# EAGLE schematic PFC MINI (EAGLE 9.2.2)
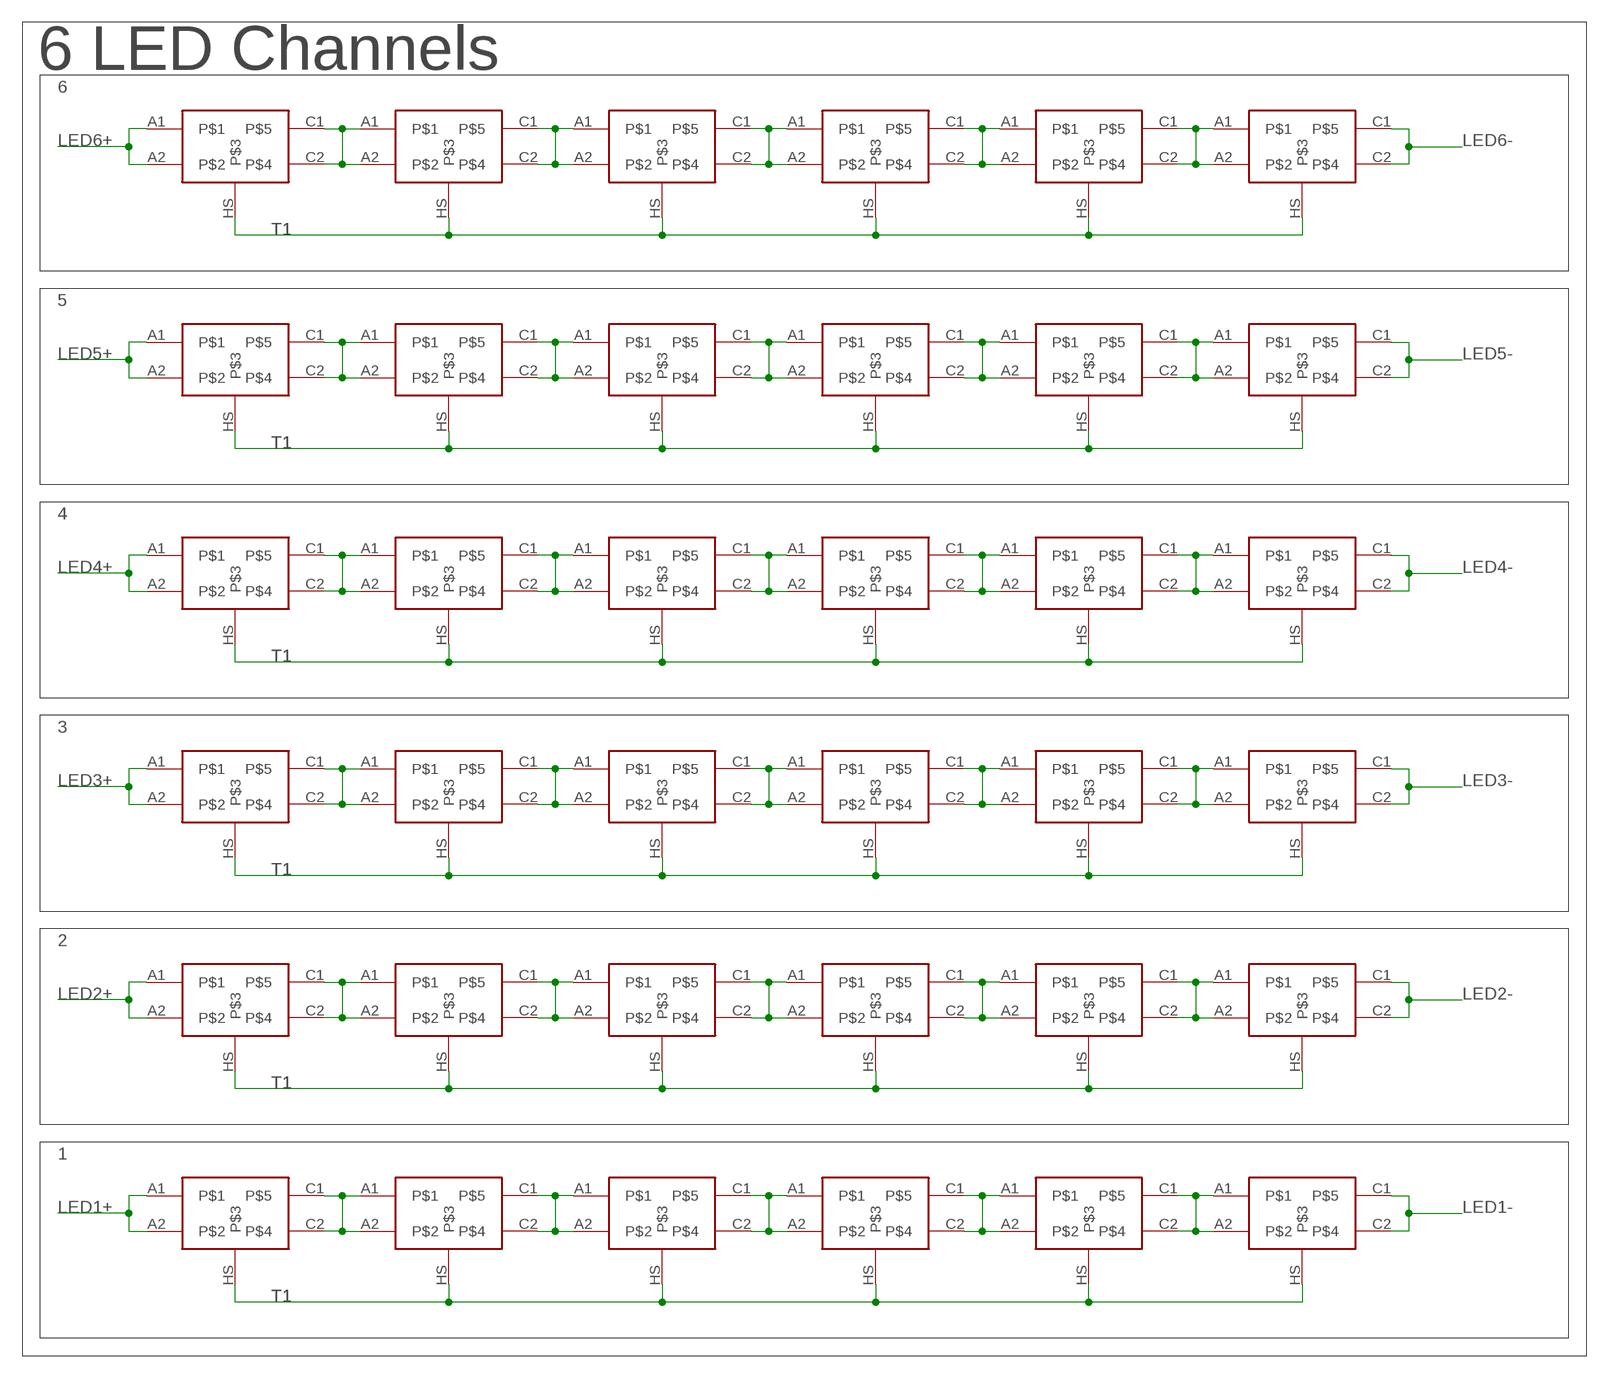
[diagram p0: schematic, sheet 1, part 1 of 3]
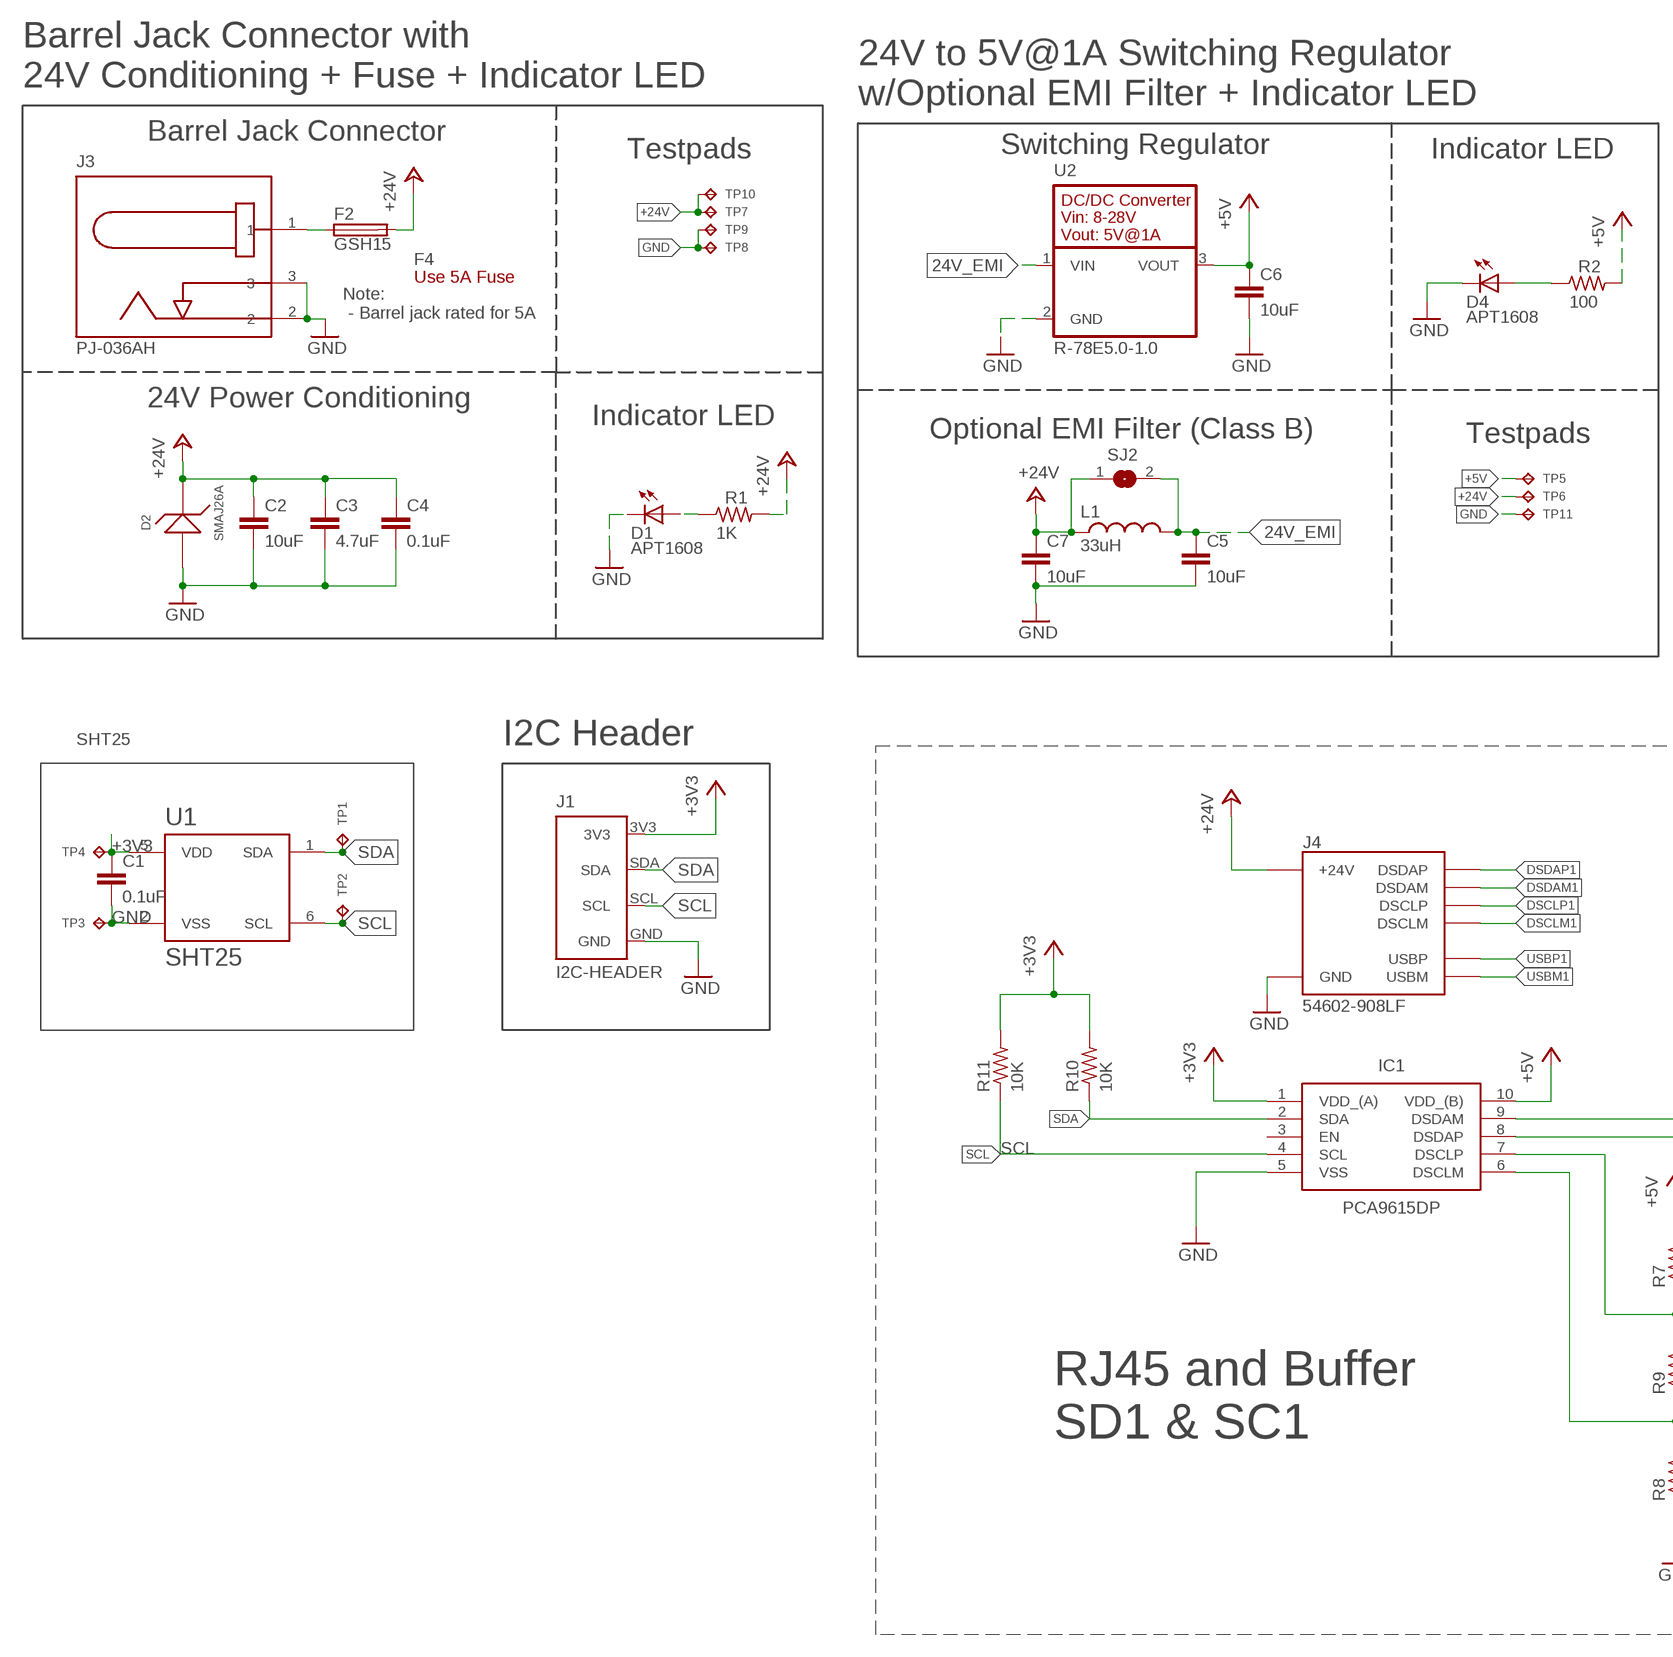
[diagram p1: schematic, sheet 1, part 2 of 3]
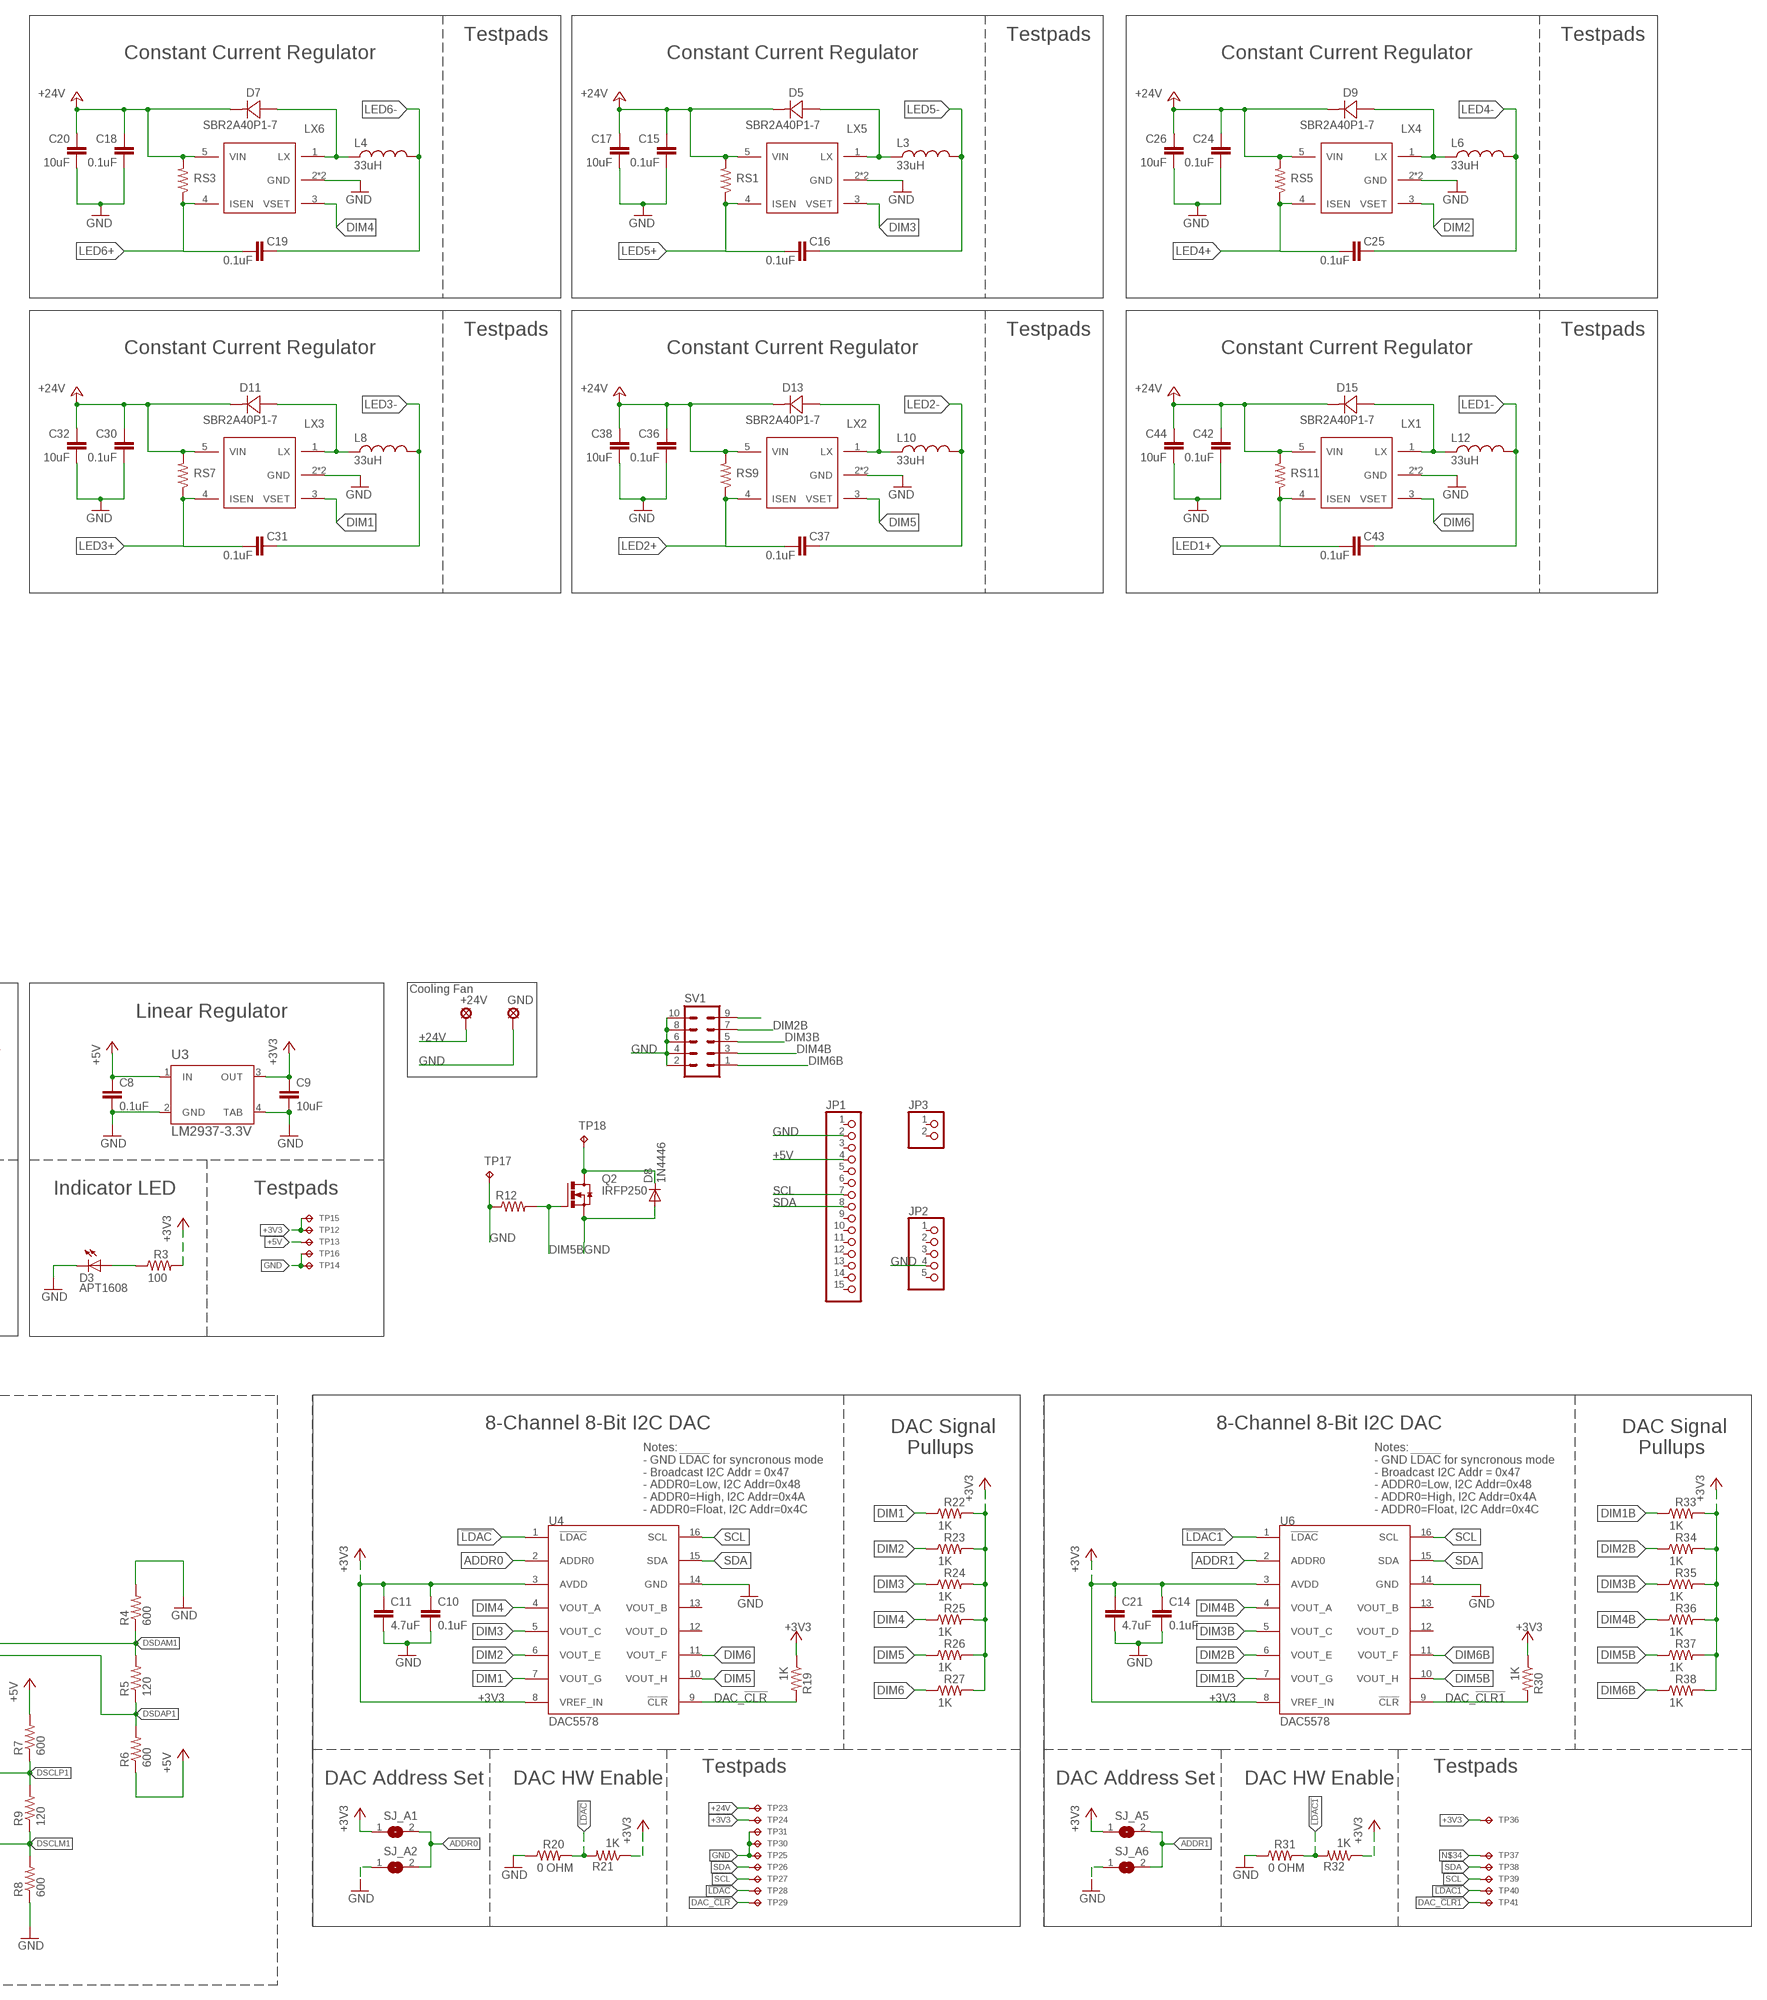
[diagram p2: schematic, sheet 1, part 3 of 3]

## Parts
+24V  LSP10  [LSP10]
C1  0.1uF  0.1UF-C0603C104K5RACTU  [C0603]
C2  10uF  10UF-GMK212BBJ106KG-T  [C0805]
C3  4.7uF  4.7UF-CL21A475KBQNNNE  [C0805]
C4  0.1uF  0.1UF-C0603C104K5RACTU  [C0603]
C5  10uF  10UF-GMK212BBJ106KG-T  [C0805]
C6  10uF  10UF-GMK212BBJ106KG-T  [C0805]
C7  10uF  10UF-GMK212BBJ106KG-T  [C0805]
C8  0.1uF  0.1UF-C0603C104K5RACTU  [C0603]
C9  10uF  10UF-GMK212BBJ106KG-T  [C0805]
C10  0.1uF  0.1UF-C0603C104K5RACTU  [C0603]
C11  4.7uF  4.7UF-CL21A475KBQNNNE  [C0805]
C14  0.1uF  0.1UF-C0603C104K5RACTU  [C0603]
C15  0.1uF  0.1UF-C0603C104K5RACTU  [C0603]
C16  0.1uF  0.1UF-C0603C104K5RACTU  [C0603]
C17  10uF  10UF-GMK212BBJ106KG-T  [C0805]
C18  0.1uF  0.1UF-C0603C104K5RACTU  [C0603]
C19  0.1uF  0.1UF-C0603C104K5RACTU  [C0603]
C20  10uF  10UF-GMK212BBJ106KG-T  [C0805]
C21  4.7uF  4.7UF-CL21A475KBQNNNE  [C0805]
C24  0.1uF  0.1UF-C0603C104K5RACTU  [C0603]
C25  0.1uF  0.1UF-C0603C104K5RACTU  [C0603]
C26  10uF  10UF-GMK212BBJ106KG-T  [C0805]
C30  0.1uF  0.1UF-C0603C104K5RACTU  [C0603]
C31  0.1uF  0.1UF-C0603C104K5RACTU  [C0603]
C32  10uF  10UF-GMK212BBJ106KG-T  [C0805]
C36  0.1uF  0.1UF-C0603C104K5RACTU  [C0603]
C37  0.1uF  0.1UF-C0603C104K5RACTU  [C0603]
C38  10uF  10UF-GMK212BBJ106KG-T  [C0805]
C42  0.1uF  0.1UF-C0603C104K5RACTU  [C0603]
C43  0.1uF  0.1UF-C0603C104K5RACTU  [C0603]
C44  10uF  10UF-GMK212BBJ106KG-T  [C0805]
D1  APT1608  APT1608CGCK  [CHIPLED_0603]
D2  SMAJ26A  SMAJ26A-13-F  [SMA]
D3  APT1608  APT1608CGCK  [CHIPLED_0603]
D4  APT1608  APT1608CGCK  [CHIPLED_0603]
D5  SBR2A40P1-7  [POWERDI123]
D7  SBR2A40P1-7  [POWERDI123]
D8  1N4446  [DO35-10]
D9  SBR2A40P1-7  [POWERDI123]
D11  SBR2A40P1-7  [POWERDI123]
D13  SBR2A40P1-7  [POWERDI123]
D15  SBR2A40P1-7  [POWERDI123]
F2  GSH15  [GSH15]
F4  Use 5A Fuse  0217005.MXP  [FUSE-CARTRIDGE]
GND  LSP10  [LSP10]
IC1  PCA9615DP  [SOP50P490X110-10N]
J1  I2C-HEADER  HEADER-I2C  [HEADER-I2C]
J3  PJ-036AH  BARREL-JACK-PJ-036AH-SMT-TR  [BARREL-JACK-PJ-036AH]
J4  54602-908LF  OPENAG-V1-RJ45PTH  [OPENAG-V1-RJ45]
JP1  PINHD-1X15  [1X15]
JP2  PINHD-1X5  [1X05]
JP3  PINHD-1X2  [1X02]
L1  33uH  33UH-29333C  [29333C]
L3  33uH  33UH-29333C  [29333C]
L4  33uH  33UH-29333C  [29333C]
L6  33uH  33UH-29333C  [29333C]
L8  33uH  33UH-29333C  [29333C]
L10  33uH  33UH-29333C  [29333C]
L12  33uH  33UH-29333C  [29333C]
Q2  IRFP250  [TO-247AD-V]
R1  1K  1K-ERJ-PB3D1001V  [RC0603N]
R2  100  100OHM-RC0603JR-07100RL  [RC0603N]
R3  100  100OHM-RC0603JR-07100RL  [RC0603N]
R4  600  R-US_R0603  [R0603]
R5  120  R-US_R0603  [R0603]
R6  600  R-US_R0603  [R0603]
R7  600  R-US_R0603  [R0603]
R8  600  R-US_R0603  [R0603]
R9  120  R-US_R0603  [R0603]
R10  10K  R-US_R0603  [R0603]
R11  10K  R-US_R0603  [R0603]
R12  R-US_R0603  [R0603]
R19  1K  1K-ERJ-PB3D1001V  [RC0603N]
R20  0 OHM  0OHM-RC0603JR-070RL  [RC0603N]
R21  1K  1K-ERJ-PB3D1001V  [RC0603N]
R22  1K  1K-ERJ-PB3D1001V  [RC0603N]
R23  1K  1K-ERJ-PB3D1001V  [RC0603N]
R24  1K  1K-ERJ-PB3D1001V  [RC0603N]
R25  1K  1K-ERJ-PB3D1001V  [RC0603N]
R26  1K  1K-ERJ-PB3D1001V  [RC0603N]
R27  1K  1K-ERJ-PB3D1001V  [RC0603N]
R30  1K  1K-ERJ-PB3D1001V  [RC0603N]
R31  0 OHM  0OHM-RC0603JR-070RL  [RC0603N]
R32  1K  1K-ERJ-PB3D1001V  [RC0603N]
R33  1K  1K-ERJ-PB3D1001V  [RC0603N]
R34  1K  1K-ERJ-PB3D1001V  [RC0603N]
R35  1K  1K-ERJ-PB3D1001V  [RC0603N]
R36  1K  1K-ERJ-PB3D1001V  [RC0603N]
R37  1K  1K-ERJ-PB3D1001V  [RC0603N]
R38  1K  1K-ERJ-PB3D1001V  [RC0603N]
RS1  6.34 ohm  6.3OHM-RC0805FR-076R34L  [R0805]
RS3  0.66 ohm  6.3OHM-RC0805FR-076R34L  [R0805]
RS5  6.34 ohm  6.3OHM-RC0805FR-076R34L  [R0805]
RS7  6.34 ohm  6.3OHM-RC0805FR-076R34L  [R0805]
RS9  6.34 ohm  6.3OHM-RC0805FR-076R34L  [R0805]
RS11  6.34 ohm  6.3OHM-RC0805FR-076R34L  [R0805]
SJ2  EMI-BYPASS  [EMI-BYPASS]
SJ_A1  SOLDERJUMPERREFLOW_NOPASTE  [SJ1]
SJ_A2  SOLDERJUMPERREFLOW_NOPASTE  [SJ1]
SJ_A5  SOLDERJUMPERREFLOW_NOPASTE  [SJ1]
SJ_A6  SOLDERJUMPERREFLOW_NOPASTE  [SJ1]
SV1  MA05-2  [MA05-2]
TP1  TPTP06R  [TP06R]
TP2  TPTP06R  [TP06R]
TP3  TPTP06R  [TP06R]
TP4  TPTP06R  [TP06R]
TP5  TPTP06R  [TP06R]
TP6  TPTP06R  [TP06R]
TP7  TPTP04R  [TP04R]
TP8  TPTP04R  [TP04R]
TP9  TPTP04R  [TP04R]
TP10  TPTP04R  [TP04R]
TP11  TPTP06R  [TP06R]
TP12  TPTP04R  [TP04R]
TP13  TPTP04R  [TP04R]
TP14  TPTP04R  [TP04R]
TP15  TPTP04R  [TP04R]
TP16  TPTP04R  [TP04R]
TP17  TPPAD1-13  [P1-13]
TP18  TPPAD1-13  [P1-13]
TP23  TPTP04R  [TP04R]
TP24  TPTP04R  [TP04R]
TP25  TPTP04R  [TP04R]
TP26  TPTP04R  [TP04R]
TP27  TPTP04R  [TP04R]
TP28  TPTP04R  [TP04R]
TP29  TPTP04R  [TP04R]
TP30  TPTP04R  [TP04R]
TP31  TPTP04R  [TP04R]
TP36  TPTP04R  [TP04R]
TP37  TPTP04R  [TP04R]
TP38  TPTP04R  [TP04R]
TP39  TPTP04R  [TP04R]
TP40  TPTP04R  [TP04R]
TP41  TPTP04R  [TP04R]
U1  SHT25  [SHT2X]
U2  R-78E5.0-1.0  [R-78E5.0-1.0]
U3  LM2937-3.3V  LM2937IMP-3.3/NOPB  [MP04A]
U4  DAC5578  DAC5578SPW  [TSSOP16]
U6  DAC5578  DAC5578SPW  [TSSOP16]
U$2  MLELED  [MLELEDCREE]
U$3  MLELED  [MLELEDCREE]
U$4  MLELED  [MLELEDCREE]
U$5  MLELED  [MLELEDCREE]
U$6  MLELED  [MLELEDCREE]
U$7  MLELED  [MLELEDCREE]
U$8  MLELED  [MLELEDCREE]
U$9  MLELED  [MLELEDCREE]
U$10  MLELED  [MLELEDCREE]
U$11  MLELED  [MLELEDCREE]
U$12  MLELED  [MLELEDCREE]
U$13  MLELED  [MLELEDCREE]
U$14  MLELED  [MLELEDCREE]
U$15  MLELED  [MLELEDCREE]
U$16  MLELED  [MLELEDCREE]
U$17  MLELED  [MLELEDCREE]
U$18  MLELED  [MLELEDCREE]
U$19  MLELED  [MLELEDCREE]
U$20  MLELED  [MLELEDCREE]
U$21  MLELED  [MLELEDCREE]
U$22  MLELED  [MLELEDCREE]
U$23  MLELED  [MLELEDCREE]
U$24  MLELED  [MLELEDCREE]
U$25  MLELED  [MLELEDCREE]
U$26  MLELED  [MLELEDCREE]
U$27  MLELED  [MLELEDCREE]
U$28  MLELED  [MLELEDCREE]
U$29  MLELED  [MLELEDCREE]
U$30  MLELED  [MLELEDCREE]
U$31  MLELED  [MLELEDCREE]
U$32  MLELED  [MLELEDCREE]
U$33  MLELED  [MLELEDCREE]
U$34  MLELED  [MLELEDCREE]
U$35  MLELED  [MLELEDCREE]
U$36  MLELED  [MLELEDCREE]
U$37  MLELED  [MLELEDCREE]
U$38  AL8861  [AL8861]
U$40  AL8861  [AL8861]
U$42  AL8861  [AL8861]
U$44  AL8861  [AL8861]
U$46  AL8861  [AL8861]
U$48  AL8861  [AL8861]

## Nets
24V_EMI: C5.1 L1.2 SJ2.2 U2.1(VIN)
24V_IN1: F2.1 J3.1
!LDAC1!: R31.2 R32.2 TP40.1(TP) U6.1(!LDAC!)
!LDAC!: R20.2 R21.2 TP28.1(TP) U4.1(!LDAC!)
+3V3: C1.1 C9.1 C10.1 C11.1 C14.1 C21.1 IC1.1(VDD_(A)) J1.3V3 R3.2 R10.2 R11.2 R19.1 R21.1 R22.2 R23.2 R24.2 R25.2 R26.2 R27.2 R30.1 R32.1 R33.2 R34.2 R35.2 R36.2 R37.2 R38.2 SJ_A1.1 SJ_A5.1 TP4.TP TP12.1(TP) TP15.1(TP) TP24.1(TP) TP36.1(TP) U1.5(VDD) U3.3(OUT) U4.3(AVDD) U4.8(VREF_IN) U6.3(AVDD) U6.8(VREF_IN)
+5V: C6.1 C8.1 IC1.10(VDD_(B)) JP1.4 R2.2 R6.1 R7.2 TP5.TP TP13.1(TP) U2.3(VOUT) U3.1(IN)
+24V: +24V.MP C2.1 C3.1 C4.1 C7.1 C15.1 C17.1 C18.1 C20.1 C24.1 C26.1 C30.1 C32.1 C36.1 C38.1 C42.1 C44.1 D2.1 D5.- D7.- D9.- D11.- D13.- D15.- F2.2 J4.24V(6)(+24V) L1.1 R1.2 RS1.2 RS3.2 RS5.2 RS7.2 RS9.2 RS11.2 SJ2.1 TP6.TP TP7.1(TP) TP10.1(TP) TP23.1(TP) U$38.5(VIN) U$40.5(VIN) U$42.5(VIN) U$44.5(VIN) U$46.5(VIN) U$48.5(VIN)
ADDR0: SJ_A1.2 SJ_A2.2 U4.2(ADDR0)
ADDR1: SJ_A5.2 SJ_A6.2 U6.2(ADDR0)
DAC_!CLR1!: R30.2 TP41.1(TP) U6.9(!CLR!)
DAC_!CLR!: R19.2 TP29.1(TP) U4.9(!CLR!)
DIM1: R22.1 U4.7(VOUT_G) U$44.3(VSET)
DIM1B: R33.1 U6.7(VOUT_G)
DIM2: R23.1 U4.6(VOUT_E) U$42.3(VSET)
DIM2B: R34.1 SV1.7 U6.6(VOUT_E)
DIM3: R24.1 U4.5(VOUT_C) U$38.3(VSET)
DIM3B: R35.1 SV1.5 U6.5(VOUT_C)
DIM4: R25.1 U4.4(VOUT_A) U$40.3(VSET)
DIM4B: R36.1 SV1.3 U6.4(VOUT_A)
DIM5: R26.1 U4.10(VOUT_H) U$46.3(VSET)
DIM5B: Q2.G R12.2 R37.1 U6.10(VOUT_H)
DIM6: R27.1 U4.11(VOUT_F) U$48.3(VSET)
DIM6B: R38.1 SV1.1 U6.11(VOUT_F)
DSCLM1: IC1.6(DSCLM) J4.DSCLM(5)(DSCLM) R8.2 R9.1
DSCLP1: IC1.7(DSCLP) J4.DSCLP(4)(DSCLP) R7.1 R9.2
DSDAM1: IC1.9(DSDAM) J4.DSDAM(2)(DSDAM) R4.1 R5.2
DSDAP1: IC1.8(DSDAP) J4.DSDAP(1)(DSDAP) R5.1 R6.2
GND: C1.2 C2.2 C3.2 C4.2 C5.2 C6.2 C7.2 C8.2 C9.2 C10.2 C11.2 C14.2 C15.2 C17.2 C18.2 C20.2 C21.2 C24.2 C26.2 C30.2 C32.2 C36.2 C38.2 C42.2 C44.2 D1.C D2.2 D3.C D4.C D8.A GND.MP IC1.5(VSS) J1.GND J3.2 J3.3 J4.GND(3)(GND) JP1.2 JP2.4 Q2.S R4.2 R8.1 R12.1 R20.1 R31.1 SJ_A2.1 SJ_A6.1 SV1.2 SV1.4 SV1.6 SV1.8 SV1.10 TP3.TP TP8.1(TP) TP9.1(TP) TP11.TP TP14.1(TP) TP16.1(TP) TP17.TP TP25.1(TP) TP30.1(TP) TP31.1(TP) U1.2(VSS) U2.2(GND) U3.2(GND) U3.4(TAB) U4.14(GND) U6.14(GND) U$38.2(GND) U$38.44(GND) U$40.2(GND) U$40.44(GND) U$42.2(GND) U$42.44(GND) U$44.2(GND) U$44.44(GND) U$46.2(GND) U$46.44(GND) U$48.2(GND) U$48.44(GND)
LED1+: C43.2 RS11.1 U$2.A1 U$2.A2 U$48.4(ISEN)
LED1-: C43.1 L12.2 U$7.C1 U$7.C2
LED2+: C37.2 RS9.1 U$8.A1 U$8.A2 U$46.4(ISEN)
LED2-: C37.1 L10.2 U$13.C1 U$13.C2
LED3+: C31.2 RS7.1 U$14.A1 U$14.A2 U$44.4(ISEN)
LED3-: C31.1 L8.2 U$19.C1 U$19.C2
LED4+: C25.2 RS5.1 U$20.A1 U$20.A2 U$42.4(ISEN)
LED4-: C25.1 L6.2 U$25.C1 U$25.C2
LED5+: C16.2 RS1.1 U$26.A1 U$26.A2 U$38.4(ISEN)
LED5-: C16.1 L3.2 U$31.C1 U$31.C2
LED6+: C19.2 RS3.1 U$32.A1 U$32.A2 U$40.4(ISEN)
LED6-: C19.1 L4.2 U$37.C1 U$37.C2
LX1: D15.+ L12.1 U$48.1(LX)
LX2: D13.+ L10.1 U$46.1(LX)
LX3: D11.+ L8.1 U$44.1(LX)
LX4: D9.+ L6.1 U$42.1(LX)
LX5: D5.+ L3.1 U$38.1(LX)
LX6: D7.+ L4.1 U$40.1(LX)
N$1: D1.A R1.1
N$2: U$2.C1 U$2.C2 U$3.A1 U$3.A2
N$3: D4.A R2.1
N$4: D3.A R3.1
N$5: U$8.C1 U$8.C2 U$9.A1 U$9.A2
N$6: U$3.C1 U$3.C2 U$4.A1 U$4.A2
N$7: U$9.C1 U$9.C2 U$10.A1 U$10.A2
N$8: U$4.C1 U$4.C2 U$5.A1 U$5.A2
N$9: U$10.C1 U$10.C2 U$11.A1 U$11.A2
N$10: U$5.C1 U$5.C2 U$6.A1 U$6.A2
N$11: U$6.C1 U$6.C2 U$7.A1 U$7.A2
N$12: U$11.C1 U$11.C2 U$12.A1 U$12.A2
N$13: U$12.C1 U$12.C2 U$13.A1 U$13.A2
N$14: U$14.C1 U$14.C2 U$15.A1 U$15.A2
N$15: U$15.C1 U$15.C2 U$16.A1 U$16.A2
N$16: U$16.C1 U$16.C2 U$17.A1 U$17.A2
N$17: U$17.C1 U$17.C2 U$18.A1 U$18.A2
N$18: U$18.C1 U$18.C2 U$19.A1 U$19.A2
N$19: U$20.C1 U$20.C2 U$21.A1 U$21.A2
N$20: U$21.C1 U$21.C2 U$22.A1 U$22.A2
N$21: U$22.C1 U$22.C2 U$23.A1 U$23.A2
N$22: U$23.C1 U$23.C2 U$24.A1 U$24.A2
N$23: U$24.C1 U$24.C2 U$25.A1 U$25.A2
N$24: U$26.C1 U$26.C2 U$27.A1 U$27.A2
N$25: U$27.C1 U$27.C2 U$28.A1 U$28.A2
N$26: U$28.C1 U$28.C2 U$29.A1 U$29.A2
N$27: U$29.C1 U$29.C2 U$30.A1 U$30.A2
N$28: U$30.C1 U$30.C2 U$31.A1 U$31.A2
N$29: U$32.C1 U$32.C2 U$33.A1 U$33.A2
N$30: U$33.C1 U$33.C2 U$34.A1 U$34.A2
N$31: U$34.C1 U$34.C2 U$35.A1 U$35.A2
N$32: U$35.C1 U$35.C2 U$36.A1 U$36.A2
N$33: U$36.C1 U$36.C2 U$37.A1 U$37.A2
N$34: TP37.1(TP)
N$36: D8.C Q2.D TP18.TP
N$38: SV1.9
SCL: IC1.4(SCL) J1.SCL JP1.7 R11.1 TP2.TP TP27.1(TP) TP39.1(TP) U1.6(SCL) U4.16(SCL) U6.16(SCL)
SDA: IC1.2(SDA) J1.SDA JP1.8 R10.1 TP1.TP TP26.1(TP) TP38.1(TP) U1.1(SDA) U4.15(SDA) U6.15(SDA)
T1: U$2.HS U$3.HS U$4.HS U$5.HS U$6.HS U$7.HS U$8.HS U$9.HS U$10.HS U$11.HS U$12.HS U$13.HS U$14.HS U$15.HS U$16.HS U$17.HS U$18.HS U$19.HS U$20.HS U$21.HS U$22.HS U$23.HS U$24.HS U$25.HS U$26.HS U$27.HS U$28.HS U$29.HS U$30.HS U$31.HS U$32.HS U$33.HS U$34.HS U$35.HS U$36.HS U$37.HS
USBM1: J4.USBM(8)(USBM)
USBP1: J4.USBP(7)(USBP)
Unconnected: IC1.3(EN) JP1.1 JP1.3 JP1.5 JP1.6 JP1.9 JP1.10 JP1.11 JP1.12 JP1.13 JP1.14 JP1.15 JP2.1 JP2.2 JP2.3 JP2.5 JP3.1 JP3.2 U4.12(VOUT_D) U4.13(VOUT_B) U6.12(VOUT_D) U6.13(VOUT_B)

## Notes on the sheet
- 6 LED Channels
- 6
- 5
- Testpads | Testpads | Testpads
- 4
- Constant Current Regulator | Constant Current Regulator | Constant Current Regulator
- 3
- 2 | Testpads | Testpads | Testpads
- Constant Current Regulator | Constant Current Regulator | Constant Current Regulator
- 1
- Barrel Jack Connector with
  24V Conditioning + Fuse + Indicator LED
- 24V to 5V@1A Switching Regulator
  w/Optional EMI Filter + Indicator LED
- Barrel Jack Connector | Cooling Fan
- Testpads | Switching Regulator | Indicator LED
- Linear Regulator
- Note:
   - Barrel jack rated for 5A
- 24V Power Conditioning
- Indicator LED
- Optional EMI Filter (Class B) | Testpads | Indicator LED | Testpads
- SHT25 | I2C Header
- 8-Channel 8-Bit I2C DAC | 8-Channel 8-Bit I2C DAC
- DAC Signal 
     Pullups
- DAC Signal 
     Pullups
- Notes:
  - GND !LDAC! for syncronous mode
  - Broadcast I2C Addr = 0x47
  - ADDR0=Low, I2C Addr=0x48
  - ADDR0=High, I2C Addr=0x4A
  - ADDR0=Float, I2C Addr=0x4C
- Notes:
  - GND !LDAC! for syncronous mode
  - Broadcast I2C Addr = 0x47
  - ADDR0=Low, I2C Addr=0x48
  - ADDR0=High, I2C Addr=0x4A
  - ADDR0=Float, I2C Addr=0x4C
- Testpads | Testpads
- DAC Address Set | DAC HW Enable | DAC Address Set | DAC HW Enable
- RJ45 and Buffer
  SD1 & SC1

## Library data of the parts
+24V GND = solpad:LSP10: SOLDER PAD drill 1.0 mm, distributor Buerklin, 12H555
C1 C4 C8 C10 C14-C16 C18 C19 C24 C25 C30 C31 C36 C37 C42 C43 = openag-capacitors:0.1UF-C0603C104K5RACTU: CAP CER 0.1UF 50V X7R 0603 Description: 0.1µF ±10% 50V Ceramic Capacitor X7R 0603 (1608 Metric) Technical Specifications: Capacitance: 0.1µF Tolerance: ±10% Rated Voltage: 50V Temperature Coefficient: X7R Operating Temperature: -55°C ~ 125°C Package / Case: 0603 (1608 Metric) Datasheet(s): X7R Dielectric, 6.3-250 VDC <https://search.kemet.com/component-edge/download/datasheet/C0603C104K5RACTU.pdf> Vendor(s): Digikey: 399-5089-1-ND <https://www.digikey.com/product-detail/en/kemet/C0603C104K5RACTU/399-5089-1-ND/1465623>; MANUFACTURER: Kemet; MPN: C0603C104K5RACTU; VENDOR: Digikey; VLINK: https://www.digikey.com/product-detail/en/kemet/C0603C104K5RACTU/399-5089-1-ND/1465623; VPN: 399-5089-1-ND
C2 C5-C7 C9 C17 C20 C26 C32 C38 C44 = openag-capacitors:10UF-GMK212BBJ106KG-T: CAP CER 10UF 35V X5R 0805 Description: 10µF ±10% 35V Ceramic Capacitor X5R 0805 (2012 Metric) Technical Specifications: Capacitance: 10µF Tolerance: ±10% Rated Voltage: 35V Temperature Coefficient: X5R Operating Temperature: -55°C ~ 85°C Package / Case: 0805 (2012 Metric) Datasheet(s): GMK212BBJ106KG-T Spec <http://ds.yuden.co.jp/TYCOMPAS/ut/detail.do?productNo=GMK212BBJ106KG-T&fileName=GMK212BBJ106KG-T_SS&mode=specSheetDownload> Vendor(s): Digikey: 587-4893-1-ND <https://www.digikey.com/product-detail/en/taiyo-yuden/GMK212BBJ106KG-T/587-4893-1-ND/6563736>; MANUFACTURER: Taiyo Yuden; MPN: GMK212BBJ106KG-T; VENDOR: Digikey; VLINK: https://www.digikey.com/product-detail/en/taiyo-yuden/GMK212BBJ106KG-T/587-4893-1-ND/6563736; VPN: 587-4893-1-ND
C3 C11 C21 = openag-capacitors:4.7UF-CL21A475KBQNNNE: CAP CER 4.7UF 50V X5R 0805 Description: 4.7µF ±10% 50V Ceramic Capacitor X5R 0805 (2012 Metric) Technical Specifications: Capacitance: 4.7uF Tolerance: ±10% Rated Voltage: 50V Temperature Coefficient: X5R Operating Temperature: -55°C ~ 85°C Package/Case: 0805 (2012 Metric) Datasheet(s): CL21A475KBQNNNE Characteristics <http://www.samsungsem.com/kr/front/downloadcms.do?path=/kr/support/product-search/mlcc/__icsFiles/afieldfile/2014/11/05&fileName=C_CL21A475KBQNNNE.pdf> Vendor(s): Digikey: 1276-1248-1-ND <https://www.digikey.com/product-detail/en/samsung-electro-mechanics/CL21A475KBQNNNE/1276-1248-1-ND/3889334>; MANUFACTURER: Samsung; MPN: CL21A475KBQNNNE; VENDOR: Digikey; VLINK: https://www.digikey.com/product-detail/en/samsung-electro-mechanics/CL21A475KBQNNNE/1276-1248-1-ND/3889334; VPN: 1276-1248-1-ND
D1 D3 D4 = openag-diodes:APT1608CGCK: LED GREEN CLEAR 0603 SMD Description: Green 570nm LED Indication - Discrete 2.1V 0603 (1608 Metric) Technical Specifications: Color: Green Lens Color: Colorless Lens Transparency: Clear Millicandela Rating: 50mcd Lens Style/Size: Rectangle with Flat Top, 1.20mm x 0.80mm Voltage - Forward (Vf) (Typ): 2.1V Current - Test: 20mA Viewing Angle: 120° Mounting Type: Surface Mount Wavelength - Dominant: 570nm Wavelength - Peak: 574nm Package / Case: 0603 (1608 Metric) Supplier Device Package: Chip LED Size / Dimension: 1.60mm L x 0.80mm W Height (Max): 0.75mm Datasheet(s): APT1608CGCK <http://www.kingbrightusa.com/images/catalog/SPEC/APT1608CGCK.pdf> Vendor(s): Digikey: 754-1116-1-ND <https://www.digikey.com/product-detail/en/kingbright/APT1608CGCK/754-1116-1-ND/1747833#>; MANUFACTURER: Kingbright; MPN: APT1608CGCK; VENDOR: Digikey; VLINK: https://www.digikey.com/product-detail/en/kingbright/APT1608CGCK/754-1116-1-ND/1747833#; VPN: 754-1116-1-ND
D2 = openag-diodes:SMAJ26A-13-F: TVS DIODE 26VWM 42.1VC SMA Description: TVS DIODE 26VWM 42.1VC SMA Technical Specifications: Type: Zener Voltage - Reverse Standoff (Typ): 26V Voltage - Breakdown (Min): 28.9V Voltage - Clamping (Max) @ Ipp: 42.1V Current - Peak Pulse (10/1000µs): 9.5A Power - Peak Pulse: 400W Power Line Protection: No Operating Temperature: -55°C ~ 150°C (TJ) DO-214AC, SMA Datasheet(s): SMAJ5.0(C)A - SMAJ200(C)A Vendor(s): Digikey: SMAJ26A-FDICT-ND <https://www.digikey.com/product-detail/en/diodes-incorporated/SMAJ26A-13-F/SMAJ26A-FDICT-ND/806583>; MANUFACTURER: Diodes Incorporated; MPN: SMAJ26A-13-F; VENDOR: Digikey; VLINK: https://www.digikey.com/product-detail/en/diodes-incorporated/SMAJ26A-13-F/SMAJ26A-FDICT-ND/806583; VPN: SMAJ26A-FDICT-ND
D5 D7 D9 D11 D13 D15 = openag-diodes:SBR2A40P1-7: DIODE SBR 40V 2A POWERDI123 Description: Diode Super Barrier 40V 2A Surface Mount PowerDI™ 123 Technical Specifications: Diode Type: Super Barrier Voltage - DC Reverse (Vr) (Max): 40V Current - Average Rectified (Io): 2A Voltage - Forward (Vf) (Max) @ If: 500mV @ 2A Speed: Standard Recovery >500ns, > 200mA (Io) Current - Reverse Leakage @ Vr: 100µA @ 40V Mounting Type: Surface Mount Package / Case: POWERDI®123 Supplier Device Package: PowerDI™ 123 Operating Temperature - Junction: -65°C ~ 150°C Base Part Number: SBR2A40 Datasheet(s): SBR2A40P1 <https://www.diodes.com/assets/Datasheets/SBR2A40P1.pdf> Vendor(s): Digikey: SBR2A40P1DITR-ND <https://www.digikey.com/product-detail/en/diodes-incorporated/SBR2A40P1-7/SBR2A40P1DITR-ND/1681825>; MANUFACTURER: Diodes Incorporated; MPN: SBR2A40P1-7; VENDOR: Digikey; VLINK: https://www.digikey.com/product-detail/en/diodes-incorporated/SBR2A40P1-7/SBR2A40P1DITR-ND/1681825; VPN: SBR2A40P1DITR-ND
D8 = diode:1N4446: DIODE high speed (Philips)
F2 = openag-fuses:GSH15: FUSE BLOCK CART 250V 6.3A PCB Description: Fuse Block 6.3A 250V 1 Circuit Cartridge PCB Technical Specifications: Fuseholder Type: Block Fuse Type: Cartridge For Use With/Related Products: 5mm x 20mm Fuse Size: 5mm x 20mm Number of Circuits: 1 Voltage: 250V Current Rating: 6.3A Mounting Type: PCB Orientation: Horizontal Termination Style: PC Pin Contact Material: Copper Alloy Contact Finish: Tin Datasheet(s): 649 Series <http://www.littelfuse.com/~/media/electronics/datasheets/fuse_blocks/littelfuse_fuse_block_649_datasheet.pdf.pdf> Vendor(s): Digikey: WK0011-ND <https://www.digikey.com/product-detail/en/littelfuse-inc/64900001039/WK0011-ND/245470>; MANUFACTURER: Littelfuse Inc.; MPN: 64900001039; VENDOR: Digikey; VLINK: https://www.digikey.com/product-detail/en/littelfuse-inc/64900001039/WK0011-ND/245470; VPN: WK0011-ND
F4 = openag-fuses:0217005.MXP: FUSE GLASS 5A 250VAC 5X20MM Description: FUSE GLASS 5A 250VAC 5X20MM Technical Specifications: Fuse Type: Cartridge, Glass Current Rating: 5A Voltage Rating - AC: 250V Response Time: Fast Package / Case: 5mm x 20mm Mounting Type: Holder Breaking Capacity @ Rated Voltage: 50A Melting I²t: 42.795 Approvals: BSI, CE, CCC, CSA, KC, PSE, SEMKO, UR, VDE Operating Temperature: -55°C ~ 125°C Size / Dimension: 0.205" Dia x 0.787" L (5.20mm x 20.00mm) DC Cold Resistance: 0.0137 Ohms Datasheet(s): 217 Series Datasheet <http://www.littelfuse.com/~/media/electronics/datasheets/fuses/littelfuse_fuse_217_datasheet.pdf.pdf> Vendor(s): Digikey: F1725-ND <https://www.digikey.com/product-detail/en/littelfuse-inc/0217005.MXP/F1725-ND/777549#>; MANUFACTURER: Littelfuse Inc.; MPN: 0217005.MXP; VENDOR: Digikey; VLINK: https://www.digikey.com/product-detail/en/littelfuse-inc/0217005.MXP/F1725-ND/777549; VPN: F1725-ND
IC1 = PCA9615DP:PCA9615DP: Buffer, ReDriver 2 Channel 400kHz 10-TSSOP Source: Datasheet <http://www.nxp.com/docs/en/data-sheet/PCA9615.pdf>; DESCRIPTION: Buffer, ReDriver 2 Channel 400kHz 10-TSSOP; HEIGHT: 1.1mm; MANUFACTURER_NAME: Nexperia; MANUFACTURER_PART_NUMBER: PCA9615DP; SUPPLIER_NAME: RS
J1 = openag-connectors:HEADER-I2C: 100 MIL HEADER I2C CONNECTIONS; MPN: N/A
J3 = openag-connectors:BARREL-JACK-PJ-036AH-SMT-TR: CONN PWR JACK 2X5.5MM SOLDER Description: Power Barrel Connector Jack 2.10mm ID (0.083"), 5.50mm OD (0.217") Surface Mount, Right Angle Technical Specifications: Connector Type: Jack Gender: Male Industry Recognized Mating Diameter: 2.10mm ID (0.083"), 5.50mm OD (0.217") Actual Diameter: 0.078" (2.00mm ID), 0.248" (6.30mm OD) Number of Positions/Contacts: 2 Conductors, 3 Contacts Internal Switch(s): Single Switch, Normally Closed Mounting Type: Surface Mount, Right Angle Termination: Solder Shielding: Unshielded Voltage - Rated: 24VDC Current Rating: 5A Mating Length/Depth: 0.360" (9.15mm) Contact Material - Plating: Silver Operating Temperature: -25°C ~ 85°C Housing Material: Polyamide (PA6T), Nylon 6T Contact Material: Brass; Copper Alloy Body Color: Black Datasheet(s): PJ-036AH-SMT-TR <http://www.cui.com/product/resource/digikeypdf/pj-036ah-smt-tr.pdf> Vendor(s): Digikey: CP-036AHPJCT-ND <https://www.digikey.com/product-detail/en/cui-inc/PJ-036AH-SMT-TR/CP-036AHPJCT-ND/1530994>; MANUFACTURER: CUI Inc.; MPN: PJ-036AH-SMT-TR; VENDOR: Digikey; VLINK: https://www.digikey.com/product-detail/en/cui-inc/PJ-036AH-SMT-TR/CP-036AHPJCT-ND/1530994; VPN: CP-036AHPJCT-ND
J4 = openag_connector:OPENAG-V1-RJ45: Amphenol FCI - 54602-908LF - CONN MOD JACK 8P8C R/A UNSHLD Description: Jack Modular Connector 8p8c (RJ45, Ethernet) 90� Angle (Right) Unshielded Cat3 Technical Specifications: Connector Type: Jack Number of Positions/Contacts: 8p8c (RJ45, Ethernet) Number of Ports: 1 Number of Rows: 1 Mounting Type: Through Hole Orientation: 90� Angle (Right) Termination: Solder Shielding: Unshielded Ratings: Cat3 Features: Board Lock LED Color: Does Not Contain LED Tab Direction: Down Contact Material: Copper Alloy Contact Finish: Gold Contact Finish Thickness: 15�in (0.38�m) Housing Material: Polyester, Glass Filled Operating Temperature: -40�C ~ 70�C Datasheet(s): 54601-x04(zzz)WPLF Drawing <http://cdn.amphenol-icc.com/media/wysiwyg/files/drawing/c-bmj-0102.pdf> Vendor(s): Digikey: 609-1046-ND <https://www.digikey.com/product-detail/en/amphenol-fci/54602-908LF/609-1046-ND/1001360>; POPULATE: YES; VERIFIED: NO
JP1 = pinhead:PINHD-1X15: PIN HEADER
JP2 = pinhead:PINHD-1X5: PIN HEADER
JP3 = pinhead:PINHD-1X2: PIN HEADER
L1 L3 L4 L6 L8 L10 L12 = openag-inductors:33UH-29333C: FIXED IND 33UH 1A 120 MOHM SMD Description: 33µH Shielded Wirewound Inductor 1A 120 mOhm Max Nonstandard Technical Specifications: Type: Wirewound Inductance: 33µH Current Rating: 1A Shielding: Shielded DC Resistance (DCR): 120 mOhm Max Operating Temperature: -40°C ~ 85°C Frequency - Test: 10kHz Mounting Type: Surface Mount Package / Case: Nonstandard Size / Dimension: 0.283" L x 0.283" W (7.20mm x 7.20mm) Height - Seated (Max): 0.157" (4.00mm) Datasheet(s): 2900 Series <https://www.murata-ps.com/data/magnetics/kmp_2900.pdf> Vendor(s): Digikey: 811-1138-1-ND <https://www.digikey.com/product-detail/en/murata-power-solutions-inc/29333C/811-1138-1-ND/1924860>; MANUFACTURER: Murata Power Solutions Inc.; MPN: 29333C; VENDOR: Digikey; VLINK: https://www.digikey.com/product-detail/en/murata-power-solutions-inc/29333C/811-1138-1-ND/1924860; VPN: 811-1138-1-ND
Q2 = transistor-power:IRFP25*: 33A/27A, 200V/150V, 0.085/0.012 Ohm, N-Channel Power MOSFET Source: Fairchild Semiconductor Corporation
R1 R19 R21-R27 R30 R32-R38 = openag-resistors:1K-ERJ-PB3D1001V: RES SMD 1K OHM 0.5% 1/5W 0603 Description: 1 kOhms ±0.5% 0.2W, 1/5W Chip Resistor 0603 (1608 Metric) Automotive AEC-Q200, Pulse Withstanding Thick Film Technical Specifications: Resistance: 1 kOhms Tolerance: ±0.5% Power: 0.2W, 1/5W Operating Temperature: -55°C ~ 155°C Package / Case: 0603 (1608 Metric) Datasheet(s): ERJ-PB3, PB6 Series, High Precision Datasheet <https://industrial.panasonic.com/cdbs/www-data/pdf/RDM0000/AOA0000C328.pdf> Vendor(s): Digikey: P20283CT-ND <https://www.digikey.com/product-detail/en/panasonic-electronic-components/ERJ-PB3D1001V/P20283CT-ND/6214538>; MANUFACTURER: Panasonic; MPN: P20283CT-ND; VENDOR: Digikey; VLINK: https://www.digikey.com/product-detail/en/panasonic-electronic-components/ERJ-PB3D1001V/P20283CT-ND/6214538; VPN: P20283CT-ND
R2 R3 = openag-resistors:100OHM-RC0603JR-07100RL: RES SMD 100 OHM 5% 1/10W 0603 Description: 100 Ohms ±5% 0.1W, 1/10W Chip Resistor 0603 (1608 Metric) Moisture Resistant Thick Film Technical Specifications: Resistance: 100 Ohms Tolerance: ±5% Power (Watts): 0.1W, 1/10W Composition: Thick Film Features: Moisture Resistant Temperature Coefficient: ±100ppm/°C Operating Temperature: -55°C ~ 155°C Package / Case: 0603 (1608 Metric) Supplier Device Package: 0603 Size / Dimension: 0.063" L x 0.032" W (1.60mm x 0.80mm) Height - Seated (Max): 0.022" (0.55mm) Number of Terminations: 2 Datasheet(s): Thick Film Chip Resistor Intro <http://www.yageo.com.tw/exep/pages/download/literatures/PYu-R_INT-thick_7.pdf> Chip Resistor Marking <http://www.yageo.com/exep/pages/download/literatures/PYu-R_Marking_2.pdf> RC Series, L Datasheet <http://www.yageo.com/documents/recent/PYu-RC_Group_51_RoHS_L_8.pdf> Vendor(s): Digikey: 311-100GRCT-ND <https://www.digikey.com/product-detail/en/yageo/RC0603JR-07100RL/311-100GRCT-ND/729644>; MANUFACTURER: Yageo; MPN: RC0603JR-07100RL; VENDOR: Digikey; VLINK: https://www.digikey.com/product-detail/en/yageo/RC0603JR-07100RL/311-100GRCT-ND/729644; VPN: 311-100GRCT-ND
R4-R12 = rcl:R-US_: RESISTOR, American symbol; SPICEPREFIX: R
R20 R31 = openag-resistors:0OHM-RC0603JR-070RL: RES SMD 0 OHM JUMPER 1/10W 0603 Description: 0 Ohms Jumper 0.1W, 1/10W Chip Resistor 0603 (1608 Metric) Moisture Resistant Thick Film Technical Specifications: Resistance: 0 Ohms Power: 0.1W, 1/10W Operating Temperature: -55°C ~ 155°C Package / Case: 0603 (1608 Metric) Datasheet(s): RC Series, L Datasheet <http://www.yageo.com/documents/recent/PYu-RC_Group_51_RoHS_L_8.pdf> Vendor(s): Digikey: 311-0.0GRCT-ND <https://www.digikey.com/product-detail/en/yageo/RC0603JR-070RL/311-0.0GRCT-ND/729622>; MANUFACTURER: Yageo; MPN: RC0603JR-070RL; VENDOR: Digikey; VLINK: https://www.digikey.com/product-detail/en/yageo/RC0603JR-070RL/311-0.0GRCT-ND/729622; VPN: 311-0.0GRCT-ND
RS1 RS5 RS7 RS9 RS11 = openag-resistors:6.3OHM-RC0805FR-076R34L: Yageo - RC0805FR-076R34L - RES SMD 6.34 OHM 1% 1/8W 0805 Description: 6.34 Ohms ±1% 0.125W, 1/8W Chip Resistor 0805 (2012 Metric) Moisture Resistant Thick Film Technical Specifications: Resistance: 6.34 Ohms Tolerance: ±1% Power: 0.125W, 1/8W Temperature Coefficient: ±200ppm/°C Operating Temperature: -55°C ~ 155°C Packaging / Case: 0805 (2012 Metric) Datasheet(s): RC Series, L Datasheet Vendor(s): Digikey: 311-6.34CRCT-ND <https://www.digikey.com/product-detail/en/yageo/RC0805FR-076R34L/311-6.34CRCT-ND/731003>; POPULATE: YES; VERIFIED: NO
RS3 = openag-resistors:6.3OHM-RC0805FR-076R34L: Yageo - RC0805FR-076R34L - RES SMD 6.34 OHM 1% 1/8W 0805 Description: 6.34 Ohms ±1% 0.125W, 1/8W Chip Resistor 0805 (2012 Metric) Moisture Resistant Thick Film Technical Specifications: Resistance: 6.34 Ohms Tolerance: ±1% Power: 0.125W, 1/8W Temperature Coefficient: ±200ppm/°C Operating Temperature: -55°C ~ 155°C Packaging / Case: 0805 (2012 Metric) Datasheet(s): RC Series, L Datasheet Vendor(s): Digikey: 311-6.34CRCT-ND <https://www.digikey.com/product-detail/en/yageo/RC0805FR-076R34L/311-6.34CRCT-ND/731003>; POPULATE: YES; VALUE: 6.34 ohm; VERIFIED: NO
SJ2 = openag-connectors:EMI-BYPASS: EMI Bypass Solder Jumper; MPN: N/A
SJ_A1 SJ_A2 SJ_A5 SJ_A6 = openag-connectors:SOLDERJUMPER: SMD Solder JUMPER Solder the two pads together to create a connection, or remove the solder to break it. REFLOW - Use this footprint for solder paste and reflow ovens. WAVE - Use this footprint for hand-soldering (larger pads). CLOSED - Has a trace between the two pads to ensure it is closed by default. The trace needs to be cut to disable the jumper, and can be closed again by creating a solder bridge between the two pads.; MPN: N/A
SV1 = con-lstb:MA05-2: PIN HEADER; OC_FARNELL: unknown; OC_NEWARK: unknown
TP1-TP16 TP23-TP31 TP36-TP41 = openag-testpads:TP: Test pad; MPN: N/A
TP17 TP18 = testpad:TP: Test pad
U1 = openag-sensors:SHT25: SENSOR HUMI/TEMP 3V I2C 1.8% SMD Description: Humidity Temperature Sensor 0 ~ 100% RH I²C ±1.8% RH 8s Surface Mount Technical Specifications: Sensor Type: Humidity, Temperature Humidity Range: 0 ~ 100% RH Output Type: I²C Output: 12b Accuracy: ±1.8% RH Response Time: 8s Voltage - Supply: 2.1 V ~ 3.6 V Mounting Type: Surface Mount Operating Temperature: -40°C ~ 125°C Datasheet(s): SHTxx Testing Guide <https://www.sensirion.com/fileadmin/user_upload/customers/sensirion/Dokumente/2_Humidity_Sensors/Sensirion_Humidity_Sensors_Testing_Guide_V1.2.pdf> SHTxx Handling Instructions <https://www.sensirion.com/fileadmin/user_upload/customers/sensirion/Dokumente/2_Humidity_Sensors/Sensirion_Humidity_Sensors_Handling_Instructions_V4.pdf> Sensor Specification Statement <https://www.sensirion.com/fileadmin/user_upload/customers/sensirion/Dokumente/2_Humidity_Sensors/Sensirion_Humidity_Sensors_Specification_Statement_V1.pdf> SHTxx, STSxx Assembly SMD Pkgs <https://www.sensirion.com/fileadmin/user_upload/customers/sensirion/Dokumente/2_Humidity_Sensors/Sensirion_Humidity_Sensors_Handling_of_SMD_Packages_V1.pdf> SHT25 Datasheet <https://www.sensirion.com/fileadmin/user_upload/customers/sensirion/Dokumente/2_Humidity_Sensors/Sensirion_Humidity_Sensors_SHT25_Datasheet_V3.pdf> Vendor(s): Digikey: 1649-1008-1-ND <https://www.digikey.com/product-detail/en/sensirion-ag/SHT25/1649-1008-1-ND/5872290>; MANUFACTURER: Sensirion AG; MPN: SHT25; VENDOR: Digikey; VLINK: https://www.digikey.com/product-detail/en/sensirion-ag/SHT25/1649-1008-1-ND/5872290; VPN: 1649-1008-1-ND
U2 = openag-regulators:R-78E5.0-1.0: DC/DC CONVERTER 5V 5W Description: Linear Regulator Replacement DC DC Converter 1 Output 5V 1A 8V - 28V Input Technical Specifications: Type: Linear Regulator Replacement Number of Outputs: 1 Voltage - Input (Min): 8V Voltage - Input (Max): 28V Voltage - Output 1: 5V Current - Output (Max): 1A Power (Watts): 5W Applications: ITE (Commercial) Features: SCP Operating Temperature: -40°C ~ 85°C Efficiency: 91% Mounting Type: Through Hole Package / Case: 3-SIP Module Size / Dimension: 0.46" L x 0.33" W x 0.41" H (11.6mm x 8.5mm x 10.4mm) Datasheet(s): R-78E-1.0 Series Datasheet <https://www.recom-power.com/pdf/Innoline/R-78Exx-1.0.pdf> Vendor(s): Digikey: 945-2201-ND <https://www.digikey.com/product-detail/en/recom-power/R-78E5.0-1.0/945-2201-ND/4930585>; MANUFACTURER: Recom Power; MPN: R-78E5.0-1.0; VENDOR: Digikey; VLINK: https://www.digikey.com/product-detail/en/recom-power/R-78E5.0-1.0/945-2201-ND/4930585; VPN: 945-2201-ND
U3 = openag-regulators:LM2937IMP-3.3/NOPB: IC REG LIN 3.3V 400MA SOT223-4 Description: Linear Voltage Regulator IC Positive Fixed 1 Output 3.3V 400mA SOT-223-4 Technical Specifications: Output Configuration: Positive Output Type: Fixed Number of Regulators: 1 Voltage - Input (Max): 26V Voltage - Output (Min/Fixed): 3.3V Voltage Dropout (Max): 1V @ 50mA Current - Output: 400mA Current - Quiescent (Iq): 2mA Current - Supply (Max): 1.25A Protection Features: Over Temperature, Reverse Polarity, Short Circuit Operating Temperature: -40°C ~ 85°C Mounting Type: Surface Mount Package / Case: TO-261-4, TO-261AA Supplier Device Package: SOT-223-4 Base Part Number: LM2937 Datasheet(s): LM2937-2.5, LM2937-3.3 Datasheet <http://www.ti.com/lit/ds/symlink/lm2937-2.5.pdf> Vendor(s): Digikey: LM2937IMP-3.3/NOPBCT-ND <https://www.digikey.com/product-detail/en/texas-instruments/LM2937IMP-3.3-NOPB/LM2937IMP-3.3-NOPBCT-ND/270742#>; MANUFACTURER: Texas Instruments; MPN: LM2937IMP-3.3/NOPB; VENDOR: Digikey; VLINK: https://www.digikey.com/product-detail/en/texas-instruments/LM2937IMP-3.3-NOPB/LM2937IMP-3.3-NOPBCT-ND/270742#; VPN: LM2937IMP-3.3/NOPBCT-ND
U4 U6 = openag-dacs:DAC5578SPW: IC DAC 8BIT I2C OCTAL 16TSSOP Description: 8 Bit Digital to Analog Converter 8 16-TSSOP Technical Specifications: Number of Bits: 8 Number of D/A Converters: 8 Settling Time: 12µs (Typ) Output Type: Voltage - Buffered Differential Output: No Data Interface: I²C Reference Type: External Voltage - Supply, Analog: 2.7 V ~ 5.5 V Voltage - Supply, Digital: 2.7 V ~ 5.5 V INL/DNL (LSB): ±0.01, ±0.01 Architecture: String DAC Operating Temperature: -40°C ~ 125°C Package / Case: 16-TSSOP (0.173", 4.40mm Width) Supplier Device Package: 16-TSSOP Base Part Number: DAC5578 Datasheet(s): DAC5578,6578,7578 <http://www.ti.com/lit/ds/symlink/dac5578.pdf> Analog Signal Chain Guide <http://www.ti.com/lit/pdf/slyb174> Vendor(s): Digikey: 296-27736-5-ND <https://www.digikey.com/product-detail/en/texas-instruments/DAC5578SPW/296-27736-5-ND/2360827>; MANUFACTURER: Texas Instruments; MPN: DAC5578SPW; VENDOR: Digikey; VLINK: https://www.digikey.com/product-detail/en/texas-instruments/DAC5578SPW/296-27736-5-ND/2360827; VPN: 296-27736-5-ND
U$2-U$37 = MidPowerLED:MLELED
U$38 U$40 U$42 U$44 U$46 U$48 = openag-driver-IC:AL8861: AL8861 LED Driver IC Description: IC LED DRVR REG PWM 1.5A SOT89-5 Technical Specifications: Type: IC Voltage In: 4.5V - 40V Current Out: Up to 1.5A Frequency: 1Mhz Dimming: PWM or Analog Package SOT-89-5 Operating Temperature: -40°C ~ 85°C (TA) Datasheet(s): Diodes AL8861 <https://www.mouser.com/ds/2/115/AL8861-1094677.pdf> Vendor(s): Digikey: Diodes AL8861 <https://www.digikey.com/product-detail/en/diodes-incorporated/AL8861Y-13/AL8861Y-13DICT-ND/6702378>

## Net classes
0 default: width 0.305 mm, drill 0.254 mm, clearance 0.254 mm